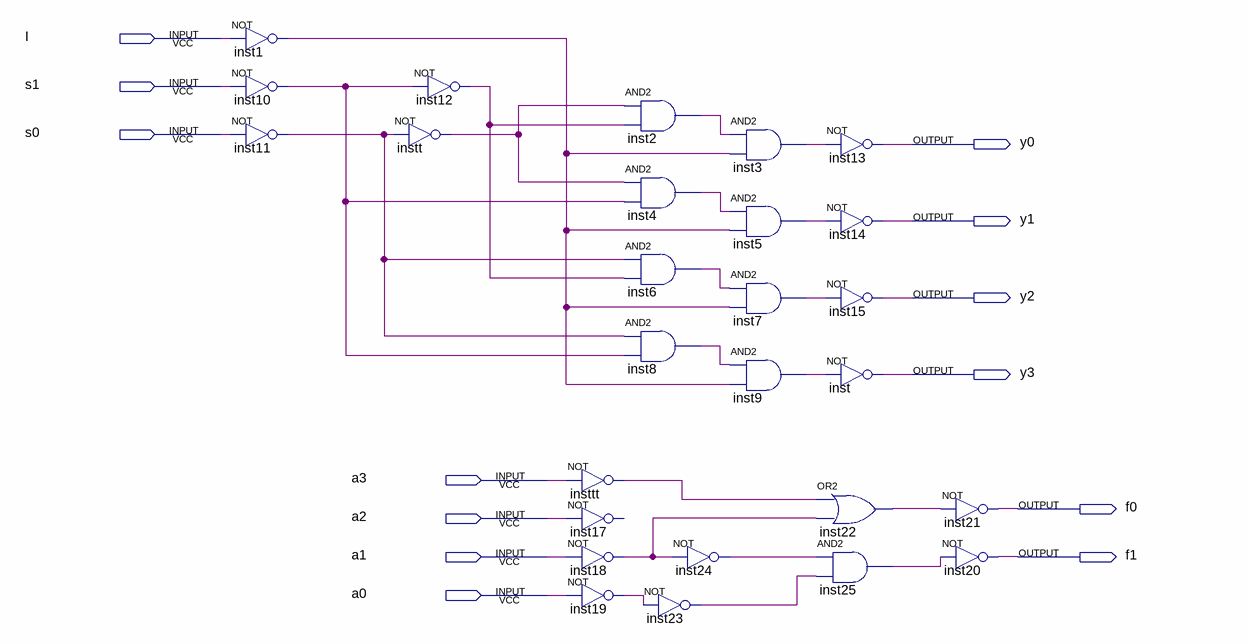
[diagram p0: schematic sheet]
// Quartus schematic lab4.bdf as structural Verilog: 27 symbols, 13 pins
module lab4 (
  input  I,
  input  s1,
  input  s0,
  input  a3,
  input  a2,
  input  a1,
  input  a0,
  output y0,
  output y1,
  output y2,
  output y3,
  output f0,
  output f1
);

  wire inst1_out, inst2_out, inst3_out, inst4_out, inst5_out, inst6_out, inst7_out, inst8_out, inst9_out,
       inst10_out, inst11_out, inst12_out, inst18_out, inst19_out, inst22_out, inst23_out, inst24_out,
       inst25_out, instt_out, insttt_out;

  not inst1 (inst1_out, I);
  not inst10 (inst10_out, s1);
  not inst11 (inst11_out, s0);
  not inst12 (inst12_out, inst10_out);
  not instt (instt_out, inst11_out);
  not insttt (insttt_out, a3);
  // NOT inst17 has open pins: IN=a2, OUT=open
  not inst18 (inst18_out, a1);
  not inst19 (inst19_out, a0);
  and inst2 (inst2_out, instt_out, inst12_out);
  and inst4 (inst4_out, instt_out, inst10_out);
  and inst6 (inst6_out, inst11_out, inst12_out);
  and inst8 (inst8_out, inst11_out, inst10_out);
  not inst23 (inst23_out, inst19_out);
  not inst24 (inst24_out, inst18_out);
  and inst3 (inst3_out, inst2_out, inst1_out);
  and inst5 (inst5_out, inst4_out, inst1_out);
  and inst7 (inst7_out, inst6_out, inst1_out);
  and inst9 (inst9_out, inst8_out, inst1_out);
  not inst13 (y0, inst3_out);
  not inst14 (y1, inst5_out);
  not inst15 (y2, inst7_out);
  not inst (y3, inst9_out);
  or inst22 (inst22_out, insttt_out, inst18_out);
  and inst25 (inst25_out, inst24_out, inst23_out);
  not inst21 (f0, inst22_out);
  not inst20 (f1, inst25_out);
endmodule
